# EAGLE design SHIELD (EAGLE 7.2.0)
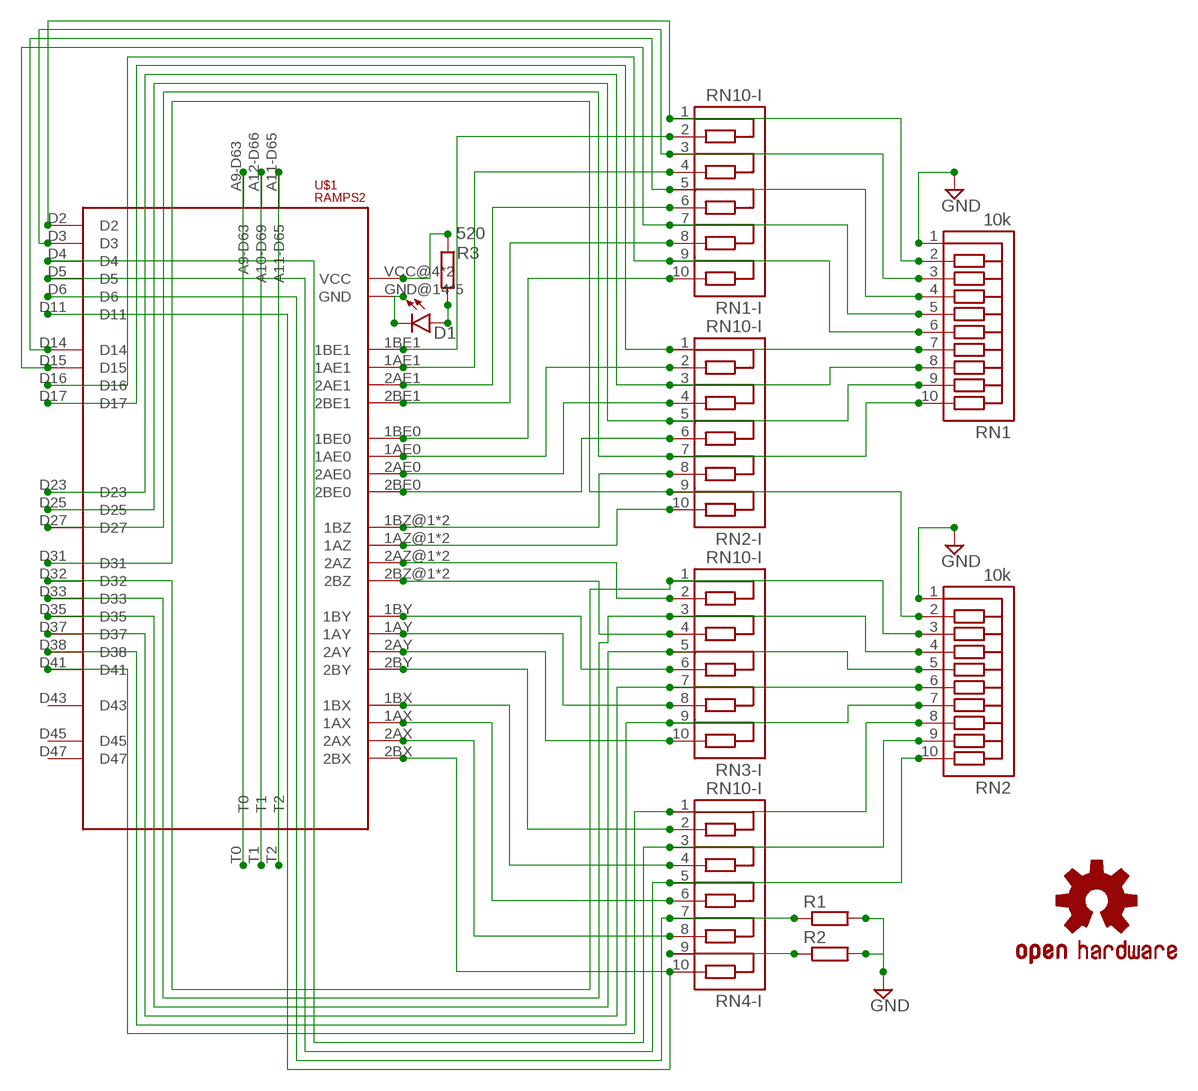
[diagram p0: schematic, sheet 1]

## Parts
D1  LED-3MM-NO_SILK  [LED3MM-NS]
LOGO2  OSHW-LOGOL-COPPER  [OSHW-LOGO-L_COPPER]
R1  R-EU_0204/7  [0204/7]
R2  R-EU_0204/7  [0204/7]
R3  520  R-EU_0204/7  [0204/7]
RN1  10k  RN10  [RN10]
RN1-I  RN10-I  [RN10]
RN2  10k  RN10  [RN10]
RN2-I  RN10-I  [RN10]
RN3-I  RN10-I  [RN10]
RN4-I  RN10-I  [RN10]
U$1  RAMPS2  [RAMPS2]

## Nets
GND: R1.2 R2.2 RN1.1 RN2.1
N$1: RN1.8 RN2-I.3 U$1.D23
N$2: RN3-I.2 U$1.2AZ@1(2AZ) U$1.2AZ@2(2AZ)
N$4: RN3-I.6 U$1.1BY
N$5: RN3-I.10 U$1.2AY
N$6: RN4-I.2 U$1.2BY
N$7: RN4-I.4 U$1.1BX
N$8: RN4-I.6 U$1.1AX
N$9: RN3-I.8 U$1.1AY
N$10: D1.K(C) U$1.GND@14(GND) U$1.GND@16(GND) U$1.GND@17(GND) U$1.GND@18(GND) U$1.GND@19(GND)
N$13: R3.1 U$1.VCC@4(VCC) U$1.VCC@6(VCC)
N$14: R1.1 RN4-I.7 U$1.D6
N$15: RN3-I.4 U$1.2BZ@1(2BZ) U$1.2BZ@2(2BZ)
N$16: D1.A R3.2
N$17: RN4-I.10 U$1.2BX U$1.D11
N$18: R2.1 RN4-I.9
N$23: U$1.A11-D65 U$1.T2
N$24: U$1.A12-D66(A10-D69) U$1.T1
N$25: U$1.A9-D63 U$1.T0
N$26: RN1.7 RN2-I.1 U$1.D17
N$27: RN1-I.9 RN1.6 U$1.D16
N$34: RN1.9 RN2-I.5 U$1.D25
N$36: RN2-I.9 RN2.2 U$1.D31
N$42: RN1-I.2 U$1.1BE1
N$44: RN1-I.4 U$1.1AE1
N$46: RN1-I.6 U$1.2AE1
N$48: RN1-I.8 U$1.2BE1
N$50: RN1-I.10 U$1.1BE0
N$52: RN2-I.2 U$1.1AE0
N$54: RN2-I.4 U$1.2AE0
N$55: RN2-I.6 U$1.2BE0
N$58: RN2-I.8 U$1.1BZ@1(1BZ) U$1.1BZ@2(1BZ)
N$60: RN2-I.10 U$1.1AZ@1(1AZ) U$1.1AZ@2(1AZ)
N$79: RN4-I.8 U$1.2AX
N$81: RN1-I.1 RN1.2 U$1.D2
N$82: RN1-I.3 RN1.3 U$1.D3
N$83: RN1-I.5 RN1.4 U$1.D14
N$84: RN1-I.7 RN1.5 U$1.D15
N$89: RN1.10 RN2-I.7 U$1.D27
N$91: RN2.3 RN3-I.1 U$1.D32
N$92: RN2.4 RN3-I.3 U$1.D33
N$93: RN2.5 RN3-I.5 U$1.D35
N$94: RN2.6 RN3-I.7 U$1.D37
N$95: RN2.7 RN3-I.9 U$1.D38
N$96: RN2.8 RN4-I.1 U$1.D41
N$97: RN2.9 RN4-I.3 U$1.D4
N$98: RN2.10 RN4-I.5 U$1.D5
Unconnected: U$1.D43 U$1.D45 U$1.D47

## Library data of the parts
D1 = SparkFun-LED:LED: LEDs Standard schematic elements and footprints for 5mm, 3mm, 1206, and 0603 sized LEDs. 5mm - Spark Fun Electronics SKU : COM-00529 (and others)
LOGO2 = RAMPS_Shield:OSHW-LOGO: Open Source Hardware Logo This logo indicates the piece of hardware it is found on incorporates a OSHW license and/or adheres to the definition of open source hardware found here: http://freedomdefined.org/OSHW
R1-R3 = resistor:R-EU_: RESISTOR, European symbol
RN1 RN2 = RAMPS_Shield:RN10: PIN HEADER; OC_FARNELL: unknown; OC_NEWARK: unknown
RN1-I RN2-I RN3-I RN4-I = RAMPS_Shield:RN10-I
U$1 = RAMPS_Shield:RAMPS2: RAMPS SHIEL

## Board
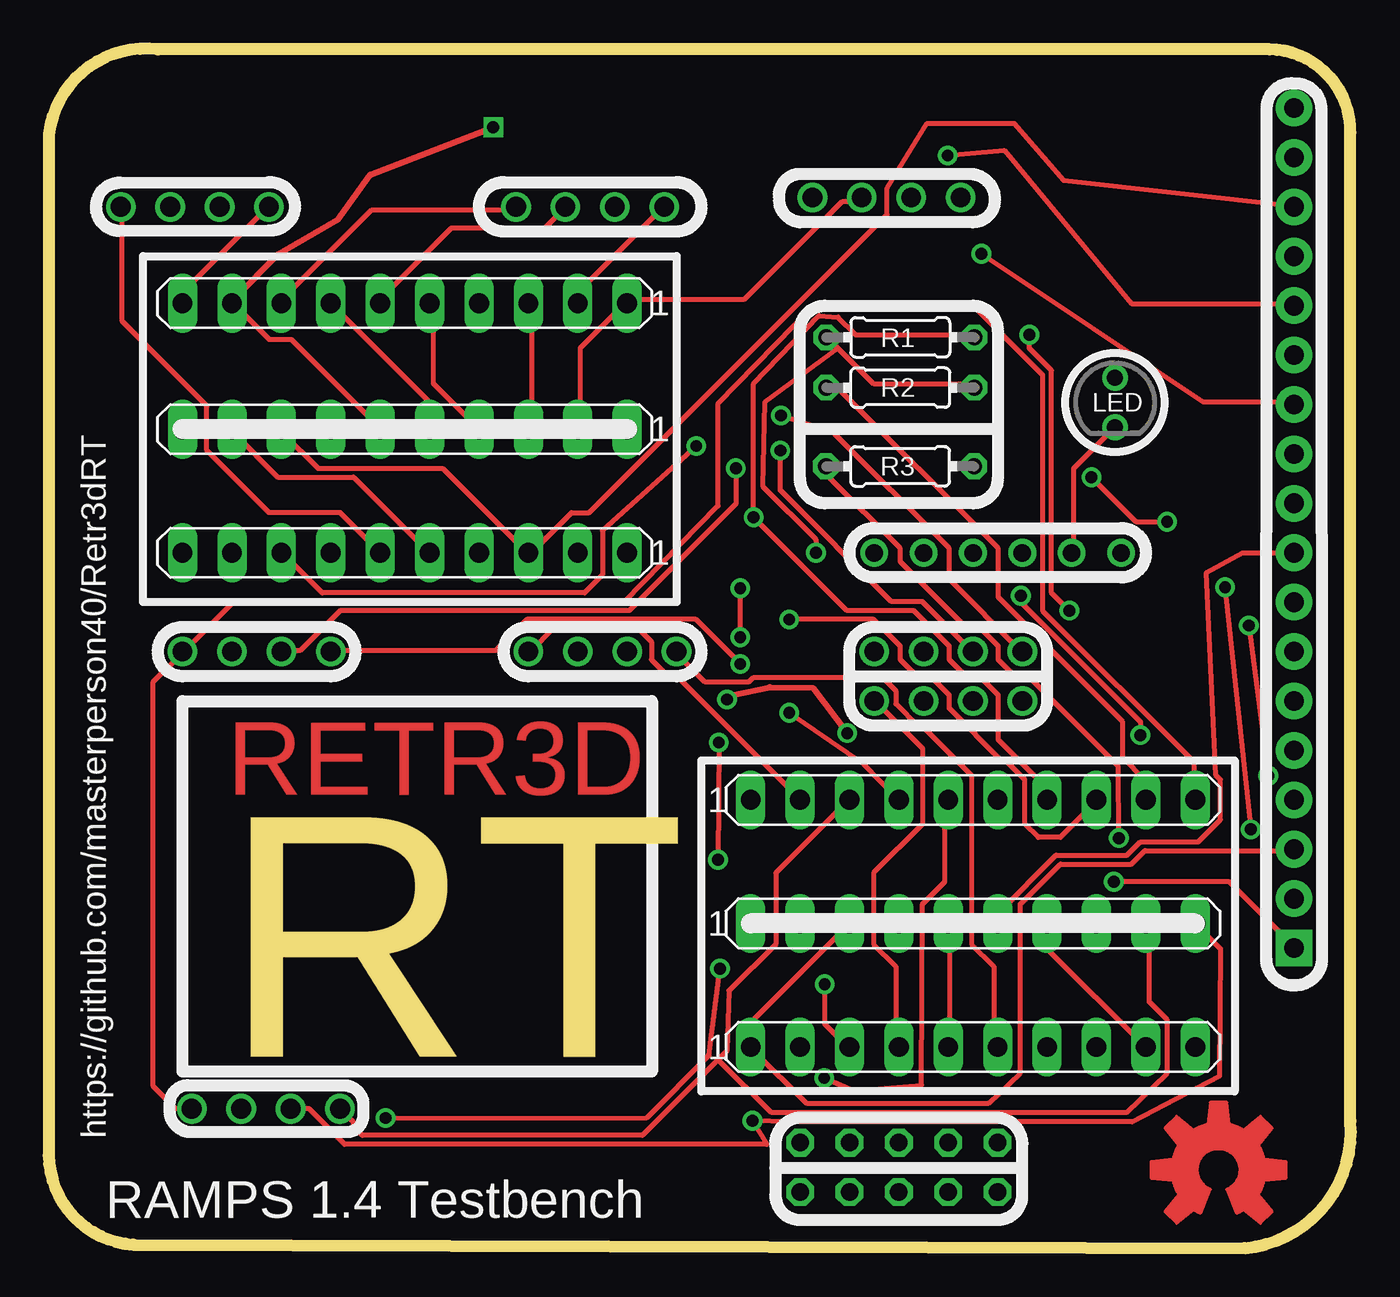
[diagram p1: board, top side]
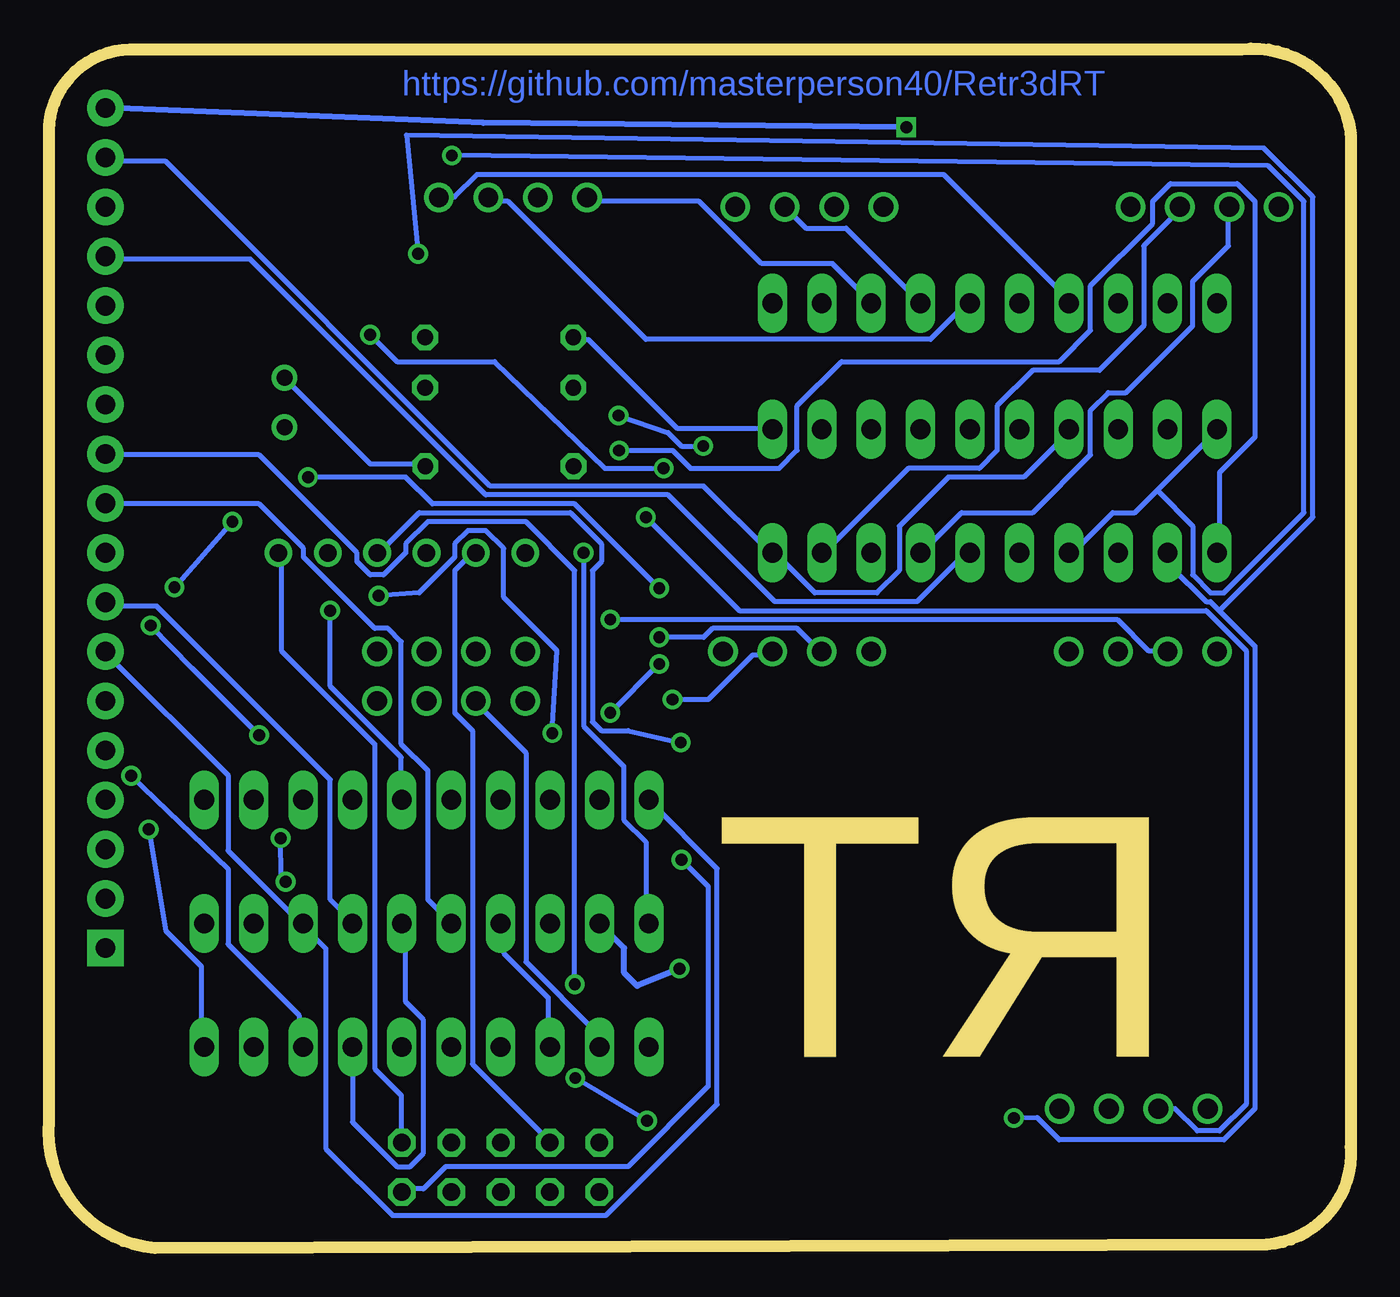
[diagram p2: board, bottom side, seen from below]

Size 66.96 x 61.65 mm. Coordinates in mm from the lower left corner, seen from the top.
Outline: 0.01,57.26 0.01,5.19 arc90 4.35,0.18 61.5,0 arc90 66.93,6.53 66.93,57.33 arc90 62.77,61.62 5.62,61.62 arc90 0.01,57.26
Copper layers (1*16): Top 0.035mm / dielectric 1.5mm / Bottom 0.035mm
Design rules "default": minimum track width 10mil, minimum drill 24mil, track to track 8mil, track to pad 8mil, pad to pad 8mil, via to via 8mil, smd to smd 8mil, copper to edge 40mil, drill to drill 8mil, minimum pad ring 10mil, minimum via ring 8mil, stop-mask expansion 4mil, vias tented up to drill 0mil, thermal gap 10mil

### Footprints (pad centres in the part's own frame; a part is rotated, then mirrored left to right if it is on the bottom)
LED3MM-NS = drill 0.813: A -1.27,0; K 1.27,0
0204/7 = drill 0.813 octagon: 1 -3.81,0; 2 3.81,0
RN10 = drill 1.016 long: 1 -11.43,0; 2 -8.89,0; 3 -6.35,0; 4 -3.81,0; 5 -1.27,0; 6 1.27,0; 7 3.81,0; 8 6.35,0; 9 8.89,0; 10 11.43,0
RAMPS2 = drill 1.016: 1AE0 -19.685,29.21; 1AE1 0.635,29.21; 1AX -16.51,6.35; 1AY 1.27,6.35; 1AZ@1 19.05,6.35; 1AZ@2 19.05,3.81; 1BE0 -17.145,29.21; 1BE1 3.175,29.21; 1BX -13.97,6.35; 1BY 3.81,6.35; 1BZ@1 21.59,6.35; 1BZ@2 21.59,3.81; 2AE0 -22.225,29.21; 2AE1 -1.905,29.21; 2AX -19.05,6.35; 2AY -1.27,6.35; 2AZ@1 16.51,6.35; 2AZ@2 16.51,3.81; 2BE0 -24.765,29.21; 2BE1 -4.445,29.21; 2BX -21.59,6.35; 2BY -3.81,6.35; 2BZ@1 13.97,6.35; 2BZ@2 13.97,3.81; D2 13.335,29.686; D3 10.795,29.686; D4 -13.494,-17.145; D5 -16.034,-17.145; D6 -18.574,-17.145; D11 -21.114,-17.145; D14 15.875,29.686; D15 18.415,29.686 | drill 0.9 pad 1.422 octagon: A5-D59 12.7,-21.431; A9-D63 12.7,-18.891; A10-D64 15.24,-21.431; A11-D65 20.32,-18.891; A12-D66 20.32,-21.431; D42 17.78,-18.891; D44 17.78,-21.431; D48 15.24,-18.891; GND@14 10.16,-18.891; VCC@4 10.16,-21.431 | drill 1.016 pad 1.88: D16 35.56,34.29; D17 35.56,31.75; D23 35.56,29.21; D25 35.56,26.67; D27 35.56,24.13; D29 35.56,21.59; D31 35.56,19.05; D32 35.56,-3.81; D33 35.56,16.51; D35 35.56,13.97; D37 35.56,11.43; D38 35.56,8.89; D41 35.56,6.35; D43 35.56,3.81; D45 35.56,1.27; D47 35.56,-1.27; GND@16 35.56,-6.35 | drill 0.9 pad 1.422: GND@17 13.97,11.43; GND@18 19.05,11.43; GND@19 24.13,11.43; T0 16.51,11.43; T1 21.59,11.43; T2 26.67,11.43 | drill 1.016 pad 1.88 square: VCC@6 35.56,-8.89

### Placement (x,y rotation side)
D1  54.83,43.47 270 top
LOGO2  60.16,4.02 0 top
R1  43.79,46.81 180 top
R2  43.79,44.23 0 top
R3  43.78,40.18 0 top
RN1  18.32,42.09 180 top
RN1-I  18.32,48.57 180 top
RN2  47.53,16.69 0 top
RN2-I  18.32,35.74 180 top
RN3-I  47.53,10.34 0 top
RN4-I  47.53,23.04 0 top
U$1  28.48,24.31 0 top

### Tracks (layer width: path | path; a pad name or v marks a point on that pad's centre or on a via)
GND  (via drill 0.61)
  Top 0.254: 40.59,46.26 40.14,46.71 R1.2 | 40.59,46.26 42.42,44.43 47.68,44.43 R2.2 | v39.45,35.74 39.45,36.43 36.71,39.17 36.82,43.47 40.59,46.26
  Bottom 0.254: v39.45,35.74 39.45,26.83 37.39,24.77 37.39,22.02 36.25,20.88 36.25,16.77 RN2.1 | RN1.1 29.85,42.14 34.65,42.14 39.22,46.71 39.91,46.71 R1.2
N$1
  Top 0.254: RN1.8 12.02,41.91 13.85,40.08 20.25,40.08 24.59,35.74 RN2-I.3 24.82,35.74 26.88,37.8 27.79,37.8 43.11,53.11 43.11,54.49 45.16,57.81 49.63,57.81 52.18,54.88 63.91,53.57 U$1.D23
N$2
  Bottom 0.254: RN3-I.2 38.76,10.37 38.76,11.05 42.42,14.71 42.42,25.45 44.94,27.97 U$1.2AZ@2
N$4
  Top 0.254: RN3-I.6 48.59,10.37 48.59,14.48 47.45,15.62 47.45,24.31 44.94,26.83 44.71,26.83 43.56,27.97 43.56,28.65 42.88,29.34 36.25,29.34 36.02,29.11 33.73,29.11 32.36,30.48 U$1.1BY
N$5  (via drill 0.61)
  Top 0.254: v60.49,33.97 v61.81,21.52 | v57.51,37.34 55.91,37.34 v53.62,39.63 | v35.56,31.4 v35.56,33.91
  Bottom 0.254: v61.81,21.52 60.94,16.31 59.11,14.48 59.11,10.37 RN3-I.10 | v57.51,37.34 v60.49,33.97 | v53.62,39.63 48.59,39.63 47.22,38.26 39.91,38.26 v35.56,33.91 | v35.56,31.4 33.28,31.4 32.82,31.85 28.48,31.85 27.33,30.71 U$1.2AY
N$6
  Top 0.254: RN4-I.2 38.53,23.17 32.36,29.34 31.91,29.34 30.99,30.25 30.99,31.17 30.31,31.85 25.96,31.85 24.82,30.71 U$1.2BY
N$7  (via drill 0.61)
  Top 0.254: v35.56,30.03 33.28,32.31 24.59,32.31 22.99,30.71 14.53,30.71 U$1.1BX | v38.08,27.51 41.92,24.86 43.56,23.17 RN4-I.4
  Bottom 0.254: v38.08,27.51 v35.56,30.03
N$8  (via drill 0.61)
  Top 0.254: v35.33,40.08 35.33,38.26 29.85,32.77 14.99,32.77 12.93,30.71 12.02,30.71 U$1.1AX | v50.42,46.94 50.42,46.26 51.57,45.11 51.57,33.68 v52.48,32.77
  Bottom 0.254: v35.33,40.08 38.36,40.08 44.02,45.57 49.05,45.57 v50.42,46.94 | v52.48,32.77 52.48,28.88 48.82,25.22 48.82,23.17 RN4-I.6
N$9  (via drill 0.61)
  Top 0.254: v61.71,32 v62.71,24.28 | v56.14,26.37 56.14,27.05 49.96,33.23 v49.99,33.54 | v34.88,28.2 35.11,28.43
  Top 0.305: 35.11,28.43 37.08,28.84 39.29,28.8 v41.06,26.47
  Bottom 0.254: v62.71,24.28 57.74,19.51 57.74,15.62 54.08,11.97 54.08,10.37 RN3-I.8 | v61.71,32 59.57,29.8 v56.14,26.37 | v49.99,33.54 47.91,33.68 46.08,35.51 46.08,36.2 45.39,36.88 44.48,36.88 43.56,35.97 43.56,33.45 40.82,30.71 v41.06,26.47 | v34.88,28.2 33.05,28.2 30.76,30.48 29.85,30.48 U$1.1AY
N$10
  Top 0.254: D1.K 54.77,42.14 52.71,40.08 52.71,35.74 U$1.GND@19
N$13  (via drill 0.61)
  Top 0.254: v55.03,21.08 54.99,24.77 50.42,29.34 49.74,29.34 48.82,30.25 48.82,30.94 47.91,31.85 47.22,31.85 43.79,35.28 43.79,35.97 40.14,39.63 40.14,40.08 R3.1 | v54.77,18.82 60.71,18.82 63.91,15.62 U$1.VCC@6
  Bottom 0.254: v55.03,21.08 54.99,19.05 v54.77,18.82
N$14  (via drill 0.61)
  Top 0.254: RN4-I.7 51.34,23.62 48.82,26.14 48.82,28.43 47.91,29.34 47.22,29.34 46.31,30.25 46.31,30.94 44.48,32.77 41.05,32.77 v36.25,37.57 36.25,44.43 39.61,47.93 40.59,47.86 41.51,46.94 47.68,46.94 R1.1
  Bottom 0.254: U$1.D6 9.05,7.17 7.9,6.02 6.76,6.02 5.39,7.39 5.39,30.71 7.45,32.77 31.45,32.77 v36.25,37.57
N$15
  Top 0.254: RN3-I.4 43.56,10.37 43.56,14.48 42.42,15.62 42.42,19.28 44.94,21.8 44.94,25.68 42.65,27.97 U$1.2BZ@2
N$16
  Bottom 0.254: R3.2 47.91,40.31 50.42,40.31 54.77,44.66 D1.A
N$17
  Top 0.254: U$1.D11 7.22,7.17 6.53,7.17 5.39,8.31 5.39,29.11 6.76,30.48 U$1.2BX 6.99,30.71 9.5,33.23 29.62,33.23 34.43,38.15 34.43,43.41 39.32,48.43 47.68,48.31 51.11,44.88 51.11,32.77 58.88,25 58.88,23.17 RN4-I.10
N$18
  Top 0.254: R2.1 40.14,44.2 40.59,44.2 48.82,35.97 48.82,33.45 55.22,27.05 55.22,25.22 56.37,24.08 56.37,23.17 RN4-I.9
N$23
  Bottom 0.254: U$1.A11-D65 48.82,5.57 48.82,7.85 50.19,9.22 50.19,25.91 54.99,30.71 54.99,35.74 U$1.T2
N$24  (via drill 0.61)
  Top 0.254: v34.46,25.99 v34.42,19.97
  Bottom 0.254: v34.42,19.97 33.05,18.6 33.05,8.31 37.16,4.19 46.54,4.19 47.68,3.05 48.59,3.05 U$1.A12-D66 | v34.46,25.99 37.16,26.6 38.53,26.6 38.99,27.05 38.99,34.83 38.53,35.28 38.53,36.2 40.14,37.8 47.91,37.8 49.96,35.74 U$1.T1
N$25
  Bottom 0.254: U$1.A9-D63 41.28,5.57 45.16,9.45 45.16,26.6 46.08,27.51 46.08,34.83 45.16,35.74 U$1.T0
N$26
  Bottom 0.254: RN1.7 14.53,41.91 16.82,39.63 20.7,39.63 23.22,37.11 23.22,34.83 24.36,33.68 27.56,33.68 29.62,35.74 RN2-I.1 29.85,35.74 33.28,39.17 44.25,39.17 60.94,55.86 63.91,55.86 U$1.D17
N$27  (via drill 0.6)
  Top 0.254: RN1.6 17.05,42.14 12.47,46.71 11.33,46.71 9.5,48.54 RN1-I.9 9.5,48.77
  Top 0.305: 9.5,48.77 11.84,51.11 14.89,52.89 16.54,55.17 v22.86,57.61
  Bottom 0.305: v22.86,57.61 44.61,57.84 U$1.D16
N$34
  Top 0.254: RN2-I.5 19.56,35.74 15.67,39.63 11.79,39.63 9.5,41.91 RN1.9
  Bottom 0.254: U$1.D25 63.91,50.83 56.59,50.83 44.48,38.71 35.11,38.71 29.62,33.23 22.3,33.23 19.79,35.74 RN2-I.5
N$36  (via drill 0.61)
  Top 0.254: v34.52,14.37 33.96,9.91 30.76,6.71 v17.32,6.68 | v47.96,51.1 59.34,43.51 63.91,43.51 U$1.D31
  Bottom 0.254: v17.32,6.68 16.13,6.71 14.99,5.57 6.53,5.57 4.93,7.17 4.93,30.94 6.76,32.77 | 6.76,32.77 7.22,33.23 7.45,33.23 9.27,35.05 9.27,35.74 RN2-I.9 | 38.53,16.54 RN2.2 | v47.96,51.1 48.56,57.2 4.47,56.54 1.96,54.03 1.96,37.57 6.76,32.77
  Bottom 0.305: v34.52,14.37 36.7,13.48 37.37,14.15 37.37,15.42 RN2.2
N$42
  Top 0.254: RN1-I.2 27.33,48.77 27.33,49.23 31.45,53.34 U$1.1BE1
N$44
  Bottom 0.254: U$1.1AE1 28.02,52.43 25.96,52.43 22.3,48.77 RN1-I.4
N$46
  Top 0.254: RN1-I.6 17.05,48.77 20.7,52.43 25.5,52.43 26.42,53.34 U$1.2AE1
N$48
  Top 0.254: RN1-I.8 12.02,48.77 16.59,53.34 23.9,53.34 U$1.2BE1
N$50
  Top 0.254: RN1-I.10 6.99,48.77 6.99,49.23 11.1,53.34 U$1.1BE0
N$52
  Bottom 0.254: RN2-I.2 27.1,35.74 22.76,40.08 19.1,40.08 18.19,41 18.19,43.28 16.36,45.11 12.93,45.11 10.65,47.4 10.65,51.51 8.82,53.34 U$1.1AE0
N$54
  Bottom 0.254: U$1.2AE0 6.3,53.34 6.3,51.51 8.13,49.69 8.13,47.4 11.56,43.97 12.47,43.97 13.39,43.06 13.39,40.77 16.36,37.8 20.02,37.8 22.08,35.74 RN2-I.4
N$55
  Top 0.254: RN2-I.6 14.99,37.8 11.33,37.8 8.13,41 8.13,43.28 3.79,47.63 3.79,53.34 U$1.2BE0
N$58  (via drill 0.61)
  Top 0.254: v33.3,41.23 28.48,36.88 28.48,34.6 27.56,33.68 14.07,33.68 12.02,35.74 RN2-I.8 | v37.65,42.79 40.36,41.91 46.31,35.97 46.31,34.37 49.96,30.71 U$1.1BZ@1
  Bottom 0.254: v33.3,41.23 34.42,41.23 35.11,41.91 v37.65,42.79
N$60  (via drill 0.61)
  Top 0.254: v37.62,41 37.62,38.94 43.34,33.23 44.94,33.23 47.45,30.71 U$1.1AZ@1
  Bottom 0.254: v37.62,41 34.88,41 33.96,40.08 29.39,40.08 28.48,41 28.48,43.28 26.19,45.57 14.99,45.57 13.39,47.17 13.39,49.46 10.19,52.66 10.19,53.8 9.27,54.71 5.85,54.71 4.93,53.8 4.93,41.68 6.76,39.86 6.76,35.74 RN2-I.10
N$79  (via drill 0.61)
  Top 0.254: v38.08,32.31 42.42,32.31 43.79,30.94 43.79,30.25 44.71,29.34 45.39,29.34 46.31,28.43 46.31,27.74 49.05,25 49.28,25 50.19,24.08 50.19,21.8 50.88,21.11 52.02,21.11 53.85,22.94 RN4-I.8
  Bottom 0.254: v38.08,32.31 12.02,32.31 10.42,30.71 9.5,30.71 U$1.2AX
N$81
  Top 0.254: RN1.2 27.33,42.14 27.33,46.26 29.62,48.54 RN1-I.1 29.85,48.77 35.79,48.77 40.82,53.8 41.74,53.8 U$1.D2
N$82
  Top 0.254: RN1.3 24.82,42.14 24.82,48.54 RN1-I.3
  Bottom 0.254: U$1.D3 39.22,53.8 33.51,53.8 30.31,50.6 26.65,50.6 24.82,48.77 RN1-I.3
N$83
  Top 0.254: RN1.4 19.79,44.43 19.79,48.54 RN1-I.5
  Bottom 0.254: U$1.D14 44.25,53.8 43.34,53.8 36.25,46.71 21.62,46.71 19.79,48.54 RN1-I.5
N$84
  Top 0.254: RN1-I.7 19.56,43.51 19.56,42.14 RN1.5
  Bottom 0.254: U$1.D15 46.76,54.03 46.08,54.03 44.94,55.17 20.93,55.17 14.53,48.77 RN1-I.7
N$89  (via drill 0.61)
  Top 0.254: v46.22,56.16 49.14,56.42 55.68,48.54 63.91,48.54 U$1.D27
  Bottom 0.254: 9.96,38.94 11.1,37.8 12.25,37.8 14.3,35.74 RN2-I.7 | 9.96,38.94 6.99,41.91 RN1.10 | v46.22,56.16 4.24,55.63 2.42,53.8 2.42,37.8 6.53,33.68 7.22,33.68 8.13,34.6 8.13,37.11 9.96,38.94
N$91
  Top 0.254: RN2.3 41.05,16.54 36.25,11.74 36.25,10.37 RN3-I.1 36.25,10.14 38.96,7.45 48.33,7.45 49.96,8.99 49.96,17.68 52.02,19.74 55.68,19.74 56.37,20.42 63.91,20.42 U$1.D32
N$92  (via drill 0.61)
  Top 0.254: v39.91,13.57 39.91,11.51 41.05,10.37 RN3-I.3
  Bottom 0.254: RN3-I.3 41.28,10.37 41.28,12.88 43.56,15.17 43.56,16.54 RN2.4 | v39.91,13.57 39.91,34.83 42.42,37.34 47.45,37.34 48.59,36.2 48.59,35.74 49.74,34.6 50.42,34.6 51.11,35.28 51.11,35.74 56.14,40.77 63.91,40.77 U$1.D33
N$93
  Top 0.254: RN3-I.5 46.31,10.37 46.31,16.54 RN2.5
  Bottom 0.254: U$1.D35 63.91,38.26 56.14,38.26 53.85,35.97 53.85,35.51 50.19,31.85 49.51,31.85 48.82,31.17 48.82,25.91 47.45,24.54 47.45,17.91 46.31,16.77 RN2.5
N$94
  Top 0.254: U$1.D37 61.39,35.74 59.53,34.72 60.02,24.31 60.25,24.08 60.25,22.02 59.11,20.88 56.14,20.88 55.45,20.2 51.79,20.2 48.82,17.22 48.82,16.77 RN2.6
  Bottom 0.254: RN3-I.7 51.34,6.48 49.05,4.19 48.36,4.19 47.68,4.88 47.68,11.74 48.59,12.65 48.59,16.54 RN2.6
N$95
  Top 0.254: RN2.7 51.34,15.4 56.37,10.37 RN3-I.9
  Bottom 0.254: U$1.D38 63.91,33 61.39,33 52.48,24.08 52.48,17.91 51.34,16.77 RN2.7
N$96
  Bottom 0.254: U$1.D41 63.91,30.48 57.74,24.31 57.74,20.42 54.08,16.77 RN2.8 53.85,16.54 52.71,15.4 52.71,5.11 49.28,1.68 38.31,1.68 32.59,7.39 32.59,19.51 36.02,22.94 RN4-I.1
N$97
  Top 0.254: 34.42,9.68 34.88,10.14 34.98,13.24 37.39,15.62 37.39,19.28 41.05,22.94 RN4-I.3 | 34.42,9.68 30.53,5.79 16.13,5.79 15.67,6.25 15.67,6.48 U$1.D4 | 34.42,9.68 37.15,6.99 55.44,6.99 57.51,8.99 57.51,11.74 56.59,12.65 56.59,16.54 RN2.9
N$98  (via drill 0.61)
  Top 0.254: U$1.D5 13.39,7.17 15.22,5.34 36.93,5.34 v36.19,6.54 38.08,6.49 55.72,6.49 60.2,8.84 60.25,15.4 RN2.10 | v39.88,8.75 41.4,8.09 44.89,8.37 44.94,17.68 46.08,18.82 46.08,22.94 RN4-I.5
  Bottom 0.254: v36.19,6.54 v39.88,8.75

### Text on the board
Top: RETR3D
Bottom: https://github.com/masterperson40/Retr3dRT
Dimension: RT
tPlace: LED | https://github.com/masterperson40/Retr3dRT | RAMPS 1.4 Testbench
tStop: https://github.com/masterperson40/Retr3dRT | RETR3D